# Altium schematic sheet Main.SchDoc
size A3; Organization: ElektronikLabor; SheetNumber: 1; Designer: ElektronikLabor; SheetName: Overview
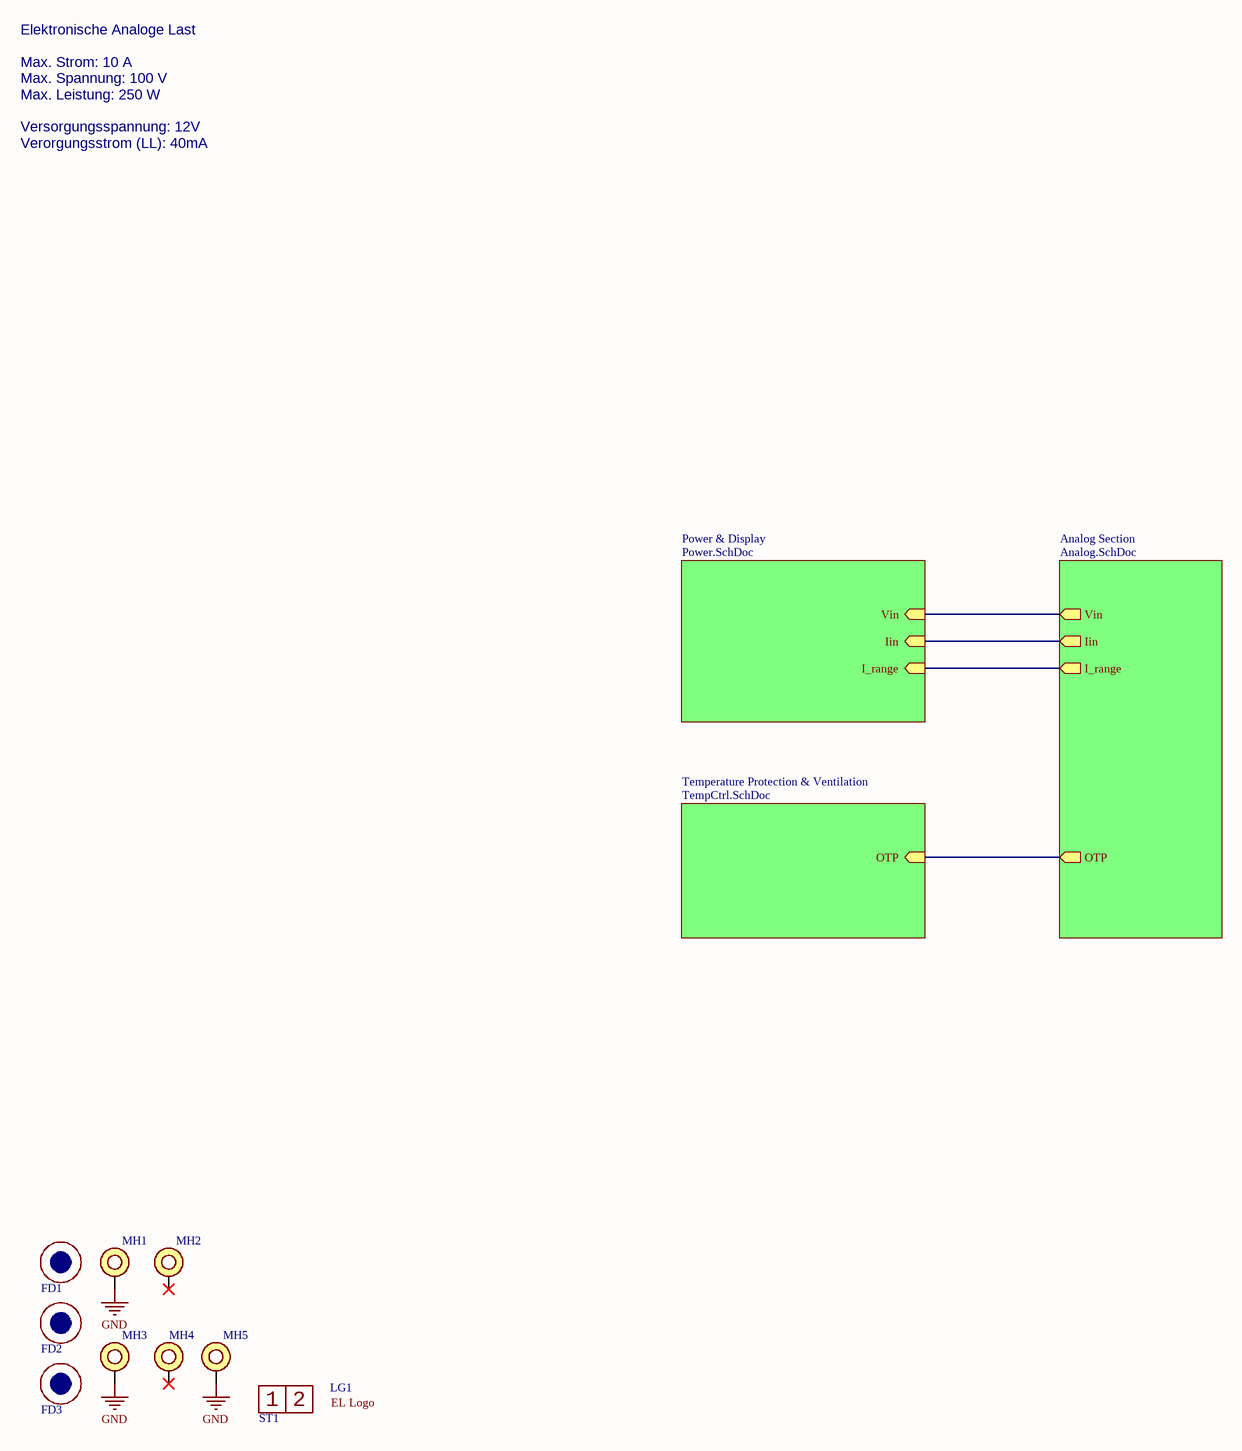
[diagram p0: Main.SchDoc]

## Parts
FD1  Fiducial Mark 1mm  [Mech Fiducial 1mm]  (value not drawn)  (no BOM)
FD2  Fiducial Mark 1mm  [Mech Fiducial 1mm]  (value not drawn)  (no BOM)
FD3  Fiducial Mark 1mm  [Mech Fiducial 1mm]  (value not drawn)  (no BOM)
LG1  EL Logo  [Mech Logo EL]  (no BOM)
MH1  3.4mm  [Mech Hole 3.4mm Plated & Restring]  (value not drawn)  (no BOM)
MH2  3.4mm  [Mech Hole 3.4mm Plated & Restring]  (value not drawn)  (no BOM)
MH3  3.4mm  [Mech Hole 3.4mm Plated & Restring]  (value not drawn)  (no BOM)
MH4  3.4mm  [Mech Hole 3.4mm Plated & Restring]  (value not drawn)  (no BOM)
MH5  3.4mm  [Mech Hole 3.4mm Plated & Restring]  (value not drawn)  (no BOM)
ST1  Layer Window 2  [Mech Layer Count 2]  (value not drawn)  (no BOM)

## Sub-sheets
Analog Section = Analog.SchDoc: I_range (out), Iin (out), Vin (out), OTP (out)
Power & Display = Power.SchDoc: I_range (in), Iin (in), Vin (in)
Temperature Protection & Ventilation = TempCtrl.SchDoc: OTP (in)

## Nets
GND: MH1.1 MH3.1 MH5.1
(unnamed): sheet Power & Display/I_range, sheet Analog Section/I_range
(unnamed): sheet Power & Display/Iin, sheet Analog Section/Iin
(unnamed): sheet Power & Display/Vin, sheet Analog Section/Vin
(unnamed): sheet Analog Section/OTP, sheet Temperature Protection & Ventilation/OTP

Not connected (* = marked no-connect by the designer): FD1 0; FD2 0; FD3 0; MH2 1*; MH4 1*

## Notes on the sheet
- Elektronische Analoge Last
  Max. Strom:	10	A
  Max. Spannung:	100	V
  Max. Leistung:	250	W
  Versorgungsspannung:	12V
  Verorgungsstrom (LL):	40mA
- Size:
- Date:
- Designer:
- A3
- Number:
- Revision:
- Page
- of
- Title:
- File:
- Sheet:
- (in symbol Mech Layer Count 2) 1; 2

## Library data of the parts
FD1-FD3 = Mech Fiducial: Mech Fiducial Mark 1mm; Value: Fiducial Mark 1mm
LG1 = Mech Logo EL: Mech Logo EL Top Layer; Value: EL Logo
MH1-MH5 = Mech Hole 3.4mm Pltd Restring 7mm: Mech Hole 3.4mm for M3 Plated & Restring; Value: 3.4mm
ST1 = Mech Layer Count 2: Mech Layer Count 2 Layers; Value: Layer Window 2